# EAGLE design NXT Shield (EAGLE 5.11)
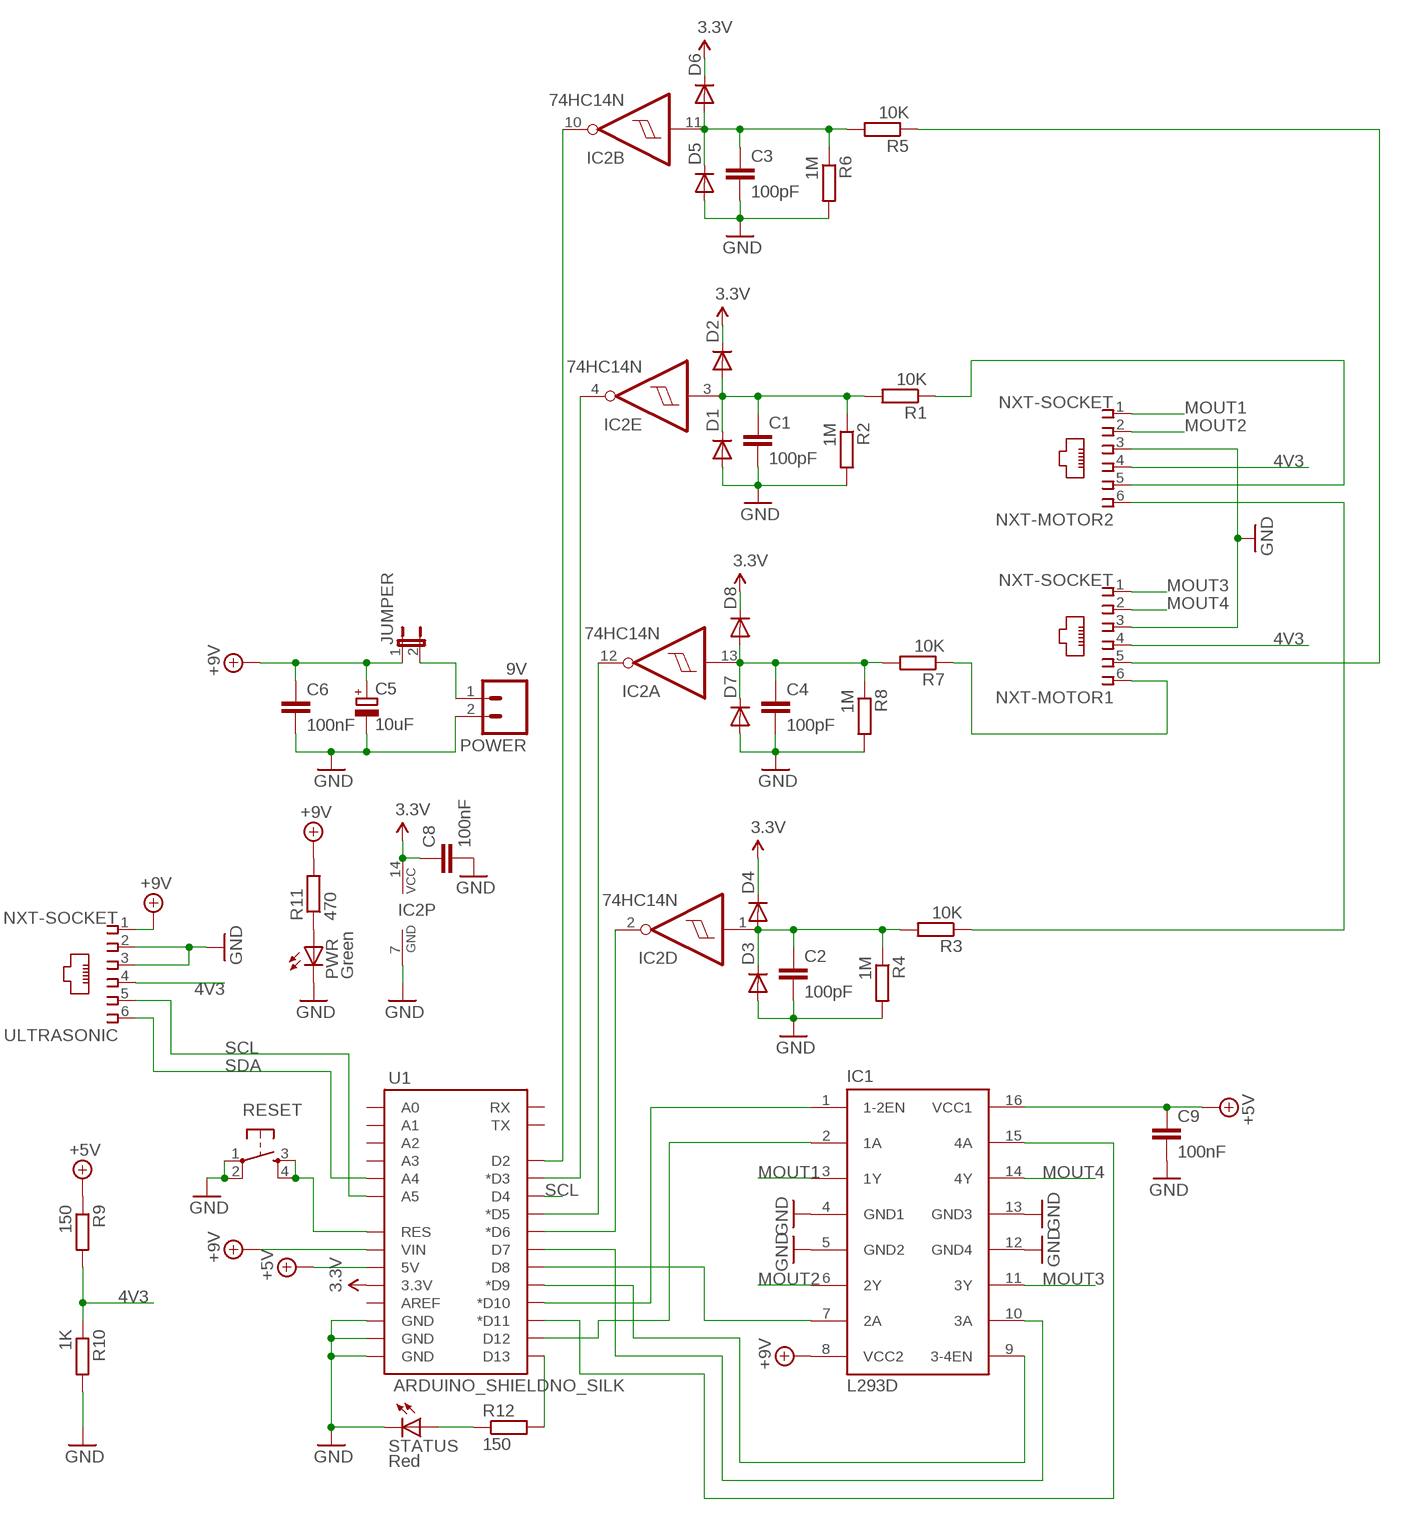
[diagram p0: schematic, sheet 1]

## Parts
C1  100pF  C-EU050-024X044  [C050-024X044]
C2  100pF  C-EU050-024X044  [C050-024X044]
C3  100pF  C-EU050-024X044  [C050-024X044]
C4  100pF  C-EU050-024X044  [C050-024X044]
C5  10uF  CPOL-EUE2-5  [E2-5]
C6  100nF  C-EU050-024X044  [C050-024X044]
C8  100nF  C-EU050-024X044  [C050-024X044]
C9  100nF  C-EU050-024X044  [C050-024X044]
D1  DIODE1N4148  [DIODE-1N4148]
D2  DIODE1N4148  [DIODE-1N4148]
D3  DIODE1N4148  [DIODE-1N4148]
D4  DIODE1N4148  [DIODE-1N4148]
D5  DIODE1N4148  [DIODE-1N4148]
D6  DIODE1N4148  [DIODE-1N4148]
D7  DIODE1N4148  [DIODE-1N4148]
D8  DIODE1N4148  [DIODE-1N4148]
IC1  L293D  [DIL16]
IC2  74HC14N  [DIL14]
JUMPER  JP1E  [JP1]
NXT-MOTOR1  NXT-SOCKET  [NXT-SOCKET]
NXT-MOTOR2  NXT-SOCKET  [NXT-SOCKET]
POWER  9V  M025MM  [SCREWTERMINAL-5MM-2]
PWR  Green  LED3MM  [LED3MM]
R1  10K  R-EU_0207/10  [0207/10]
R2  1M  R-EU_0207/10  [0207/10]
R3  10K  R-EU_0207/10  [0207/10]
R4  1M  R-EU_0207/10  [0207/10]
R5  10K  R-EU_0207/10  [0207/10]
R6  1M  R-EU_0207/10  [0207/10]
R7  10K  R-EU_0207/10  [0207/10]
R8  1M  R-EU_0207/10  [0207/10]
R9  150  R-EU_0207/10  [0207/10]
R10  1K  R-EU_0207/10  [0207/10]
R11  470  R-EU_0207/10  [0207/10]
R12  150  R-EU_0207/10  [0207/10]
RESET  TAC_SWITCHPTH  [TACTILE-PTH]
STATUS  Red  LED3MM  [LED3MM]
U1  ARDUINO_SHIELDNO_SILK  [DUEMILANOVE_VIAS]
ULTRASONIC  NXT-SOCKET  [NXT-SOCKET]

## Nets
3.3V: C8.1 D2.C D4.C D6.C D8.C IC2.14(P:VCC) U1.3.3V
4V3: NXT-MOTOR1.4 NXT-MOTOR2.4 R9.2 R10.1 ULTRASONIC.4
+5V: C9.1 IC1.16(VCC1) R9.1 U1.5V
+9V: C5.+ C6.1 IC1.8(VCC2) JUMPER.1 R11.2 U1.VIN ULTRASONIC.1
GND: C1.2 C2.2 C3.2 C4.2 C5.- C6.2 C8.2 C9.2 D1.A D3.A D5.A D7.A IC1.4(GND1) IC1.5(GND2) IC1.12(GND4) IC1.13(GND3) IC2.7(P:GND) NXT-MOTOR1.3 NXT-MOTOR2.3 POWER.2 PWR.K(C) R2.2 R4.2 R6.2 R8.2 R10.2 RESET.1 RESET.2 STATUS.K(C) U1.GND@0(GND) U1.GND@1(GND) U1.GND@2(GND) ULTRASONIC.2 ULTRASONIC.3
MOUT1: IC1.3(1Y) NXT-MOTOR2.1
MOUT2: IC1.6(2Y) NXT-MOTOR2.2
MOUT3: IC1.11(3Y) NXT-MOTOR1.1
MOUT4: IC1.14(4Y) NXT-MOTOR1.2
N$1: IC2.2(D:O) U1.D6(*D6)
N$2: IC2.12(A:O) U1.D5(*D5)
N$3: IC2.4(E:O) U1.D3(*D3)
N$4: IC2.10(B:O) U1.D2
N$5: IC1.2(1A) U1.D12
N$6: IC1.7(2A) U1.D8
N$7: IC1.1(1-2EN) U1.D10(*D10)
N$8: IC1.9(3-4EN) U1.D9(*D9)
N$9: IC1.10(3A) U1.D7
N$10: R12.1 STATUS.A
N$11: IC1.15(4A) U1.D11(*D11)
N$12: NXT-MOTOR2.6 R3.1
N$13: R12.2 U1.D13
N$14: NXT-MOTOR2.5 R1.1
N$15: RESET.3 RESET.4 U1.RES
N$16: NXT-MOTOR1.5 R5.1
N$17: PWR.A R11.1
N$21: C2.1 D3.C D4.A IC2.1(D:I) R3.2 R4.1
N$22: C1.1 D1.C D2.A IC2.3(E:I) R1.2 R2.1
N$23: C4.1 D7.C D8.A IC2.13(A:I) R7.2 R8.1
N$26: JUMPER.2 POWER.1
N$27: C3.1 D5.C D6.A IC2.11(B:I) R5.2 R6.1
NXT-MOTOR2: NXT-MOTOR1.6 R7.1
SCL: U1.A5 U1.D4 ULTRASONIC.5
SDA: U1.A4 ULTRASONIC.6
Unconnected: IC2.5(F:I) IC2.6(F:O) IC2.8(C:O) IC2.9(C:I) U1.A0 U1.A1 U1.A2 U1.A3 U1.AREF U1.RX U1.TX

## Library data of the parts
C1-C4 C6 C8 C9 = rcl:C-EU: CAPACITOR, European symbol
C5 = rcl:CPOL-EU: POLARIZED CAPACITOR, European symbol
D1-D8 = SparkFun:DIODE: Diode These are standard reverse protection diodes and small signal diodes. SMA package can handle up to about 1A. SOD-323 can handle about 200mA. What the SOD-323 package when ordering, there are some mfgs out there that are 5-pin packages.
IC1 = st-microelectronics:L293D: PUSH-PULL 4 CHANNEL DRIVER; MPN: L293D; OC_FARNELL: 9589619; OC_NEWARK: 56P8249
IC2 = 74xx-eu:74*14: Hex schmitt trigger INVERTER
JUMPER = jumper:JP1E: JUMPER
NXT-MOTOR1 NXT-MOTOR2 ULTRASONIC = Mindstorms:NXT-SOCKET: RJ11 6 connects Manufacturer: Mindsensors.com Source: NXT-Female-Socket.pdf; OC_FARNELL: unknown; OC_NEWARK: unknown
POWER = SparkFun:M02: Header 2 Standard 2-pin 0.1" header. Use with straight break away headers (SKU : PRT-00116), right angle break away headers (PRT-00553), swiss pins (PRT-00743), machine pins (PRT-00117), and female headers (PRT-00115). Molex polarized connector foot print use with SKU : PRT-08233 with associated crimp pins and housings.
PWR STATUS = led:LED: LED OSRAM: - CHIPLED LG R971, LG N971, LY N971, LG Q971, LY Q971, LO R971, LY R971 LH N974, LH R974 LS Q976, LO Q976, LY Q976 LO Q996 - Hyper CHIPLED LW Q18S LB Q993, LB Q99A, LB R99A - SideLED LS A670, LO A670, LY A670, LG A670, LP A670 LB A673, LV A673, LT A673, LW A673 LH A674 LY A675 LS A676, LA A676, LO A676, LY A676, LW A676 LS A679, LY A679, LG A679 - Hyper Micro SIDELED® LS Y876, LA Y876, LO Y876, LY Y876 LT Y87S - SmartLED LW L88C, LW L88S LB L89C, LB L89S, LG L890 LS L89K, LO L89K, LY L89K LS L896, LA L896, LO L896, LY L896 - TOPLED LS T670, LO T670, LY T670, LG T670, LP T670 LSG T670, LSP T670, LSY T670, LOP T670, LYG T670 LG T671, LOG T671, LSG T671 LB T673, LV T673, LT T673, LW T673 LH T674 LS T676, LA T676, LO T676, LY T676, LB T676, LH T676, LSB T676, LW T676 LB T67C, LV T67C, LT T67C, LS T67K, LO T67K, LY T67K, LW E67C LS E67B, LA E67B, LO E67B, LY E67B, LB E67C, LV E67C, LT E67C LW T67C LS T679, LY T679, LG T679 LS T770, LO T770, LY T770, LG T770, LP T770 LB T773, LV T773, LT T773, LW T773 LH T774 LS E675, LA E675, LY E675, LS T675 LS T776, LA T776, LO T776, LY T776, LB T776 LHGB T686 LT T68C, LB T68C - Hyper Mini TOPLED® LB M676 - Mini TOPLED Santana® LG M470 LS M47K, LO M47K, LY M47K Source: http://www.osram.convergy.de LUXEON: - LUMILED® LXK2-PW12-R00, LXK2-PW12-S00, LXK2-PW14-U00, LXK2-PW14-V00 LXK2-PM12-R00, LXK2-PM12-S00, LXK2-PM14-U00 LXK2-PE12-Q00, LXK2-PE12-R00, LXK2-PE12-S00, LXK2-PE14-T00, LXK2-PE14-U00 LXK2-PB12-K00, LXK2-PB12-L00, LXK2-PB12-M00, LXK2-PB14-N00, LXK2-PB14-P00, LXK2-PB14-Q00 LXK2-PR12-L00, LXK2-PR12-M00, LXK2-PR14-Q00, LXK2-PR14-R00 LXK2-PD12-Q00, LXK2-PD12-R00, LXK2-PD12-S00 LXK2-PH12-R00, LXK2-PH12-S00 LXK2-PL12-P00, LXK2-PL12-Q00, LXK2-PL12-R00 Source: www.luxeon.com KINGBRIGHT: KA-3528ASYC Source: www.kingbright.com
R1-R12 = rcl:R-EU_: RESISTOR, European symbol
RESET = SparkFun:TAC_SWITCH: Momentary Switch Button commonly used for reset or general input. Spark Fun Electronics SKU : COM-00097
U1 = Mindstorms:ARDUINO_SHIELD

## Board
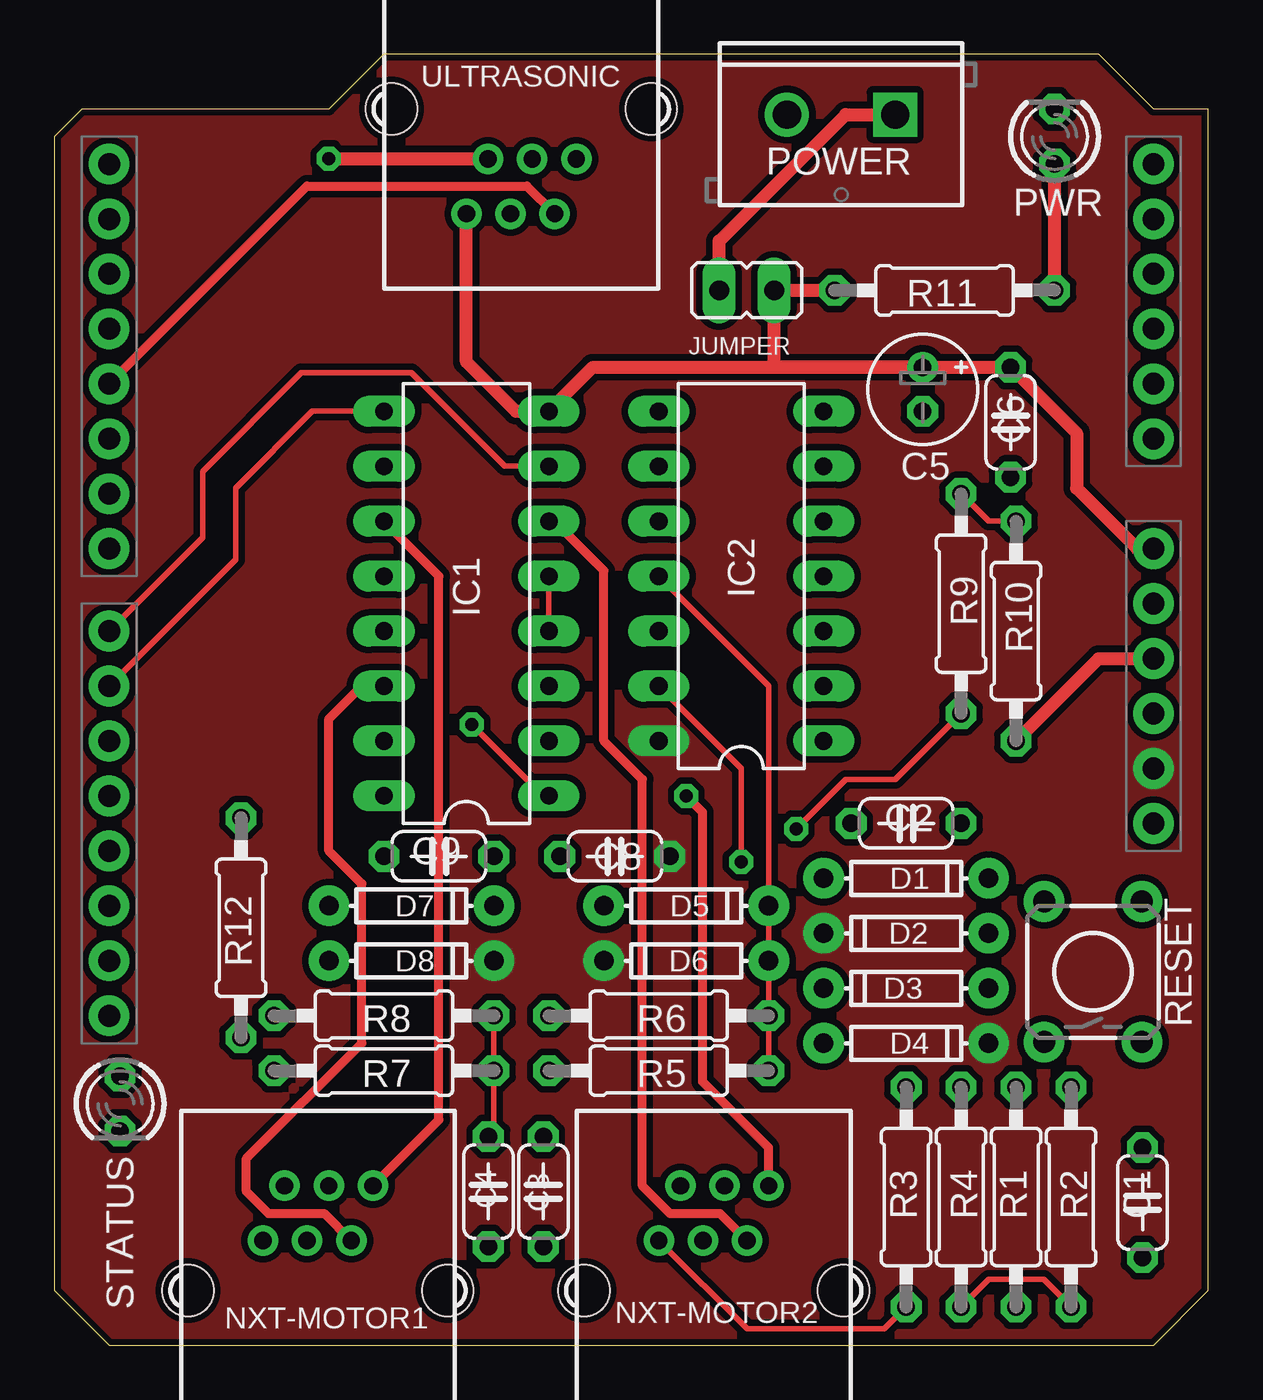
[diagram p1: board, top side]
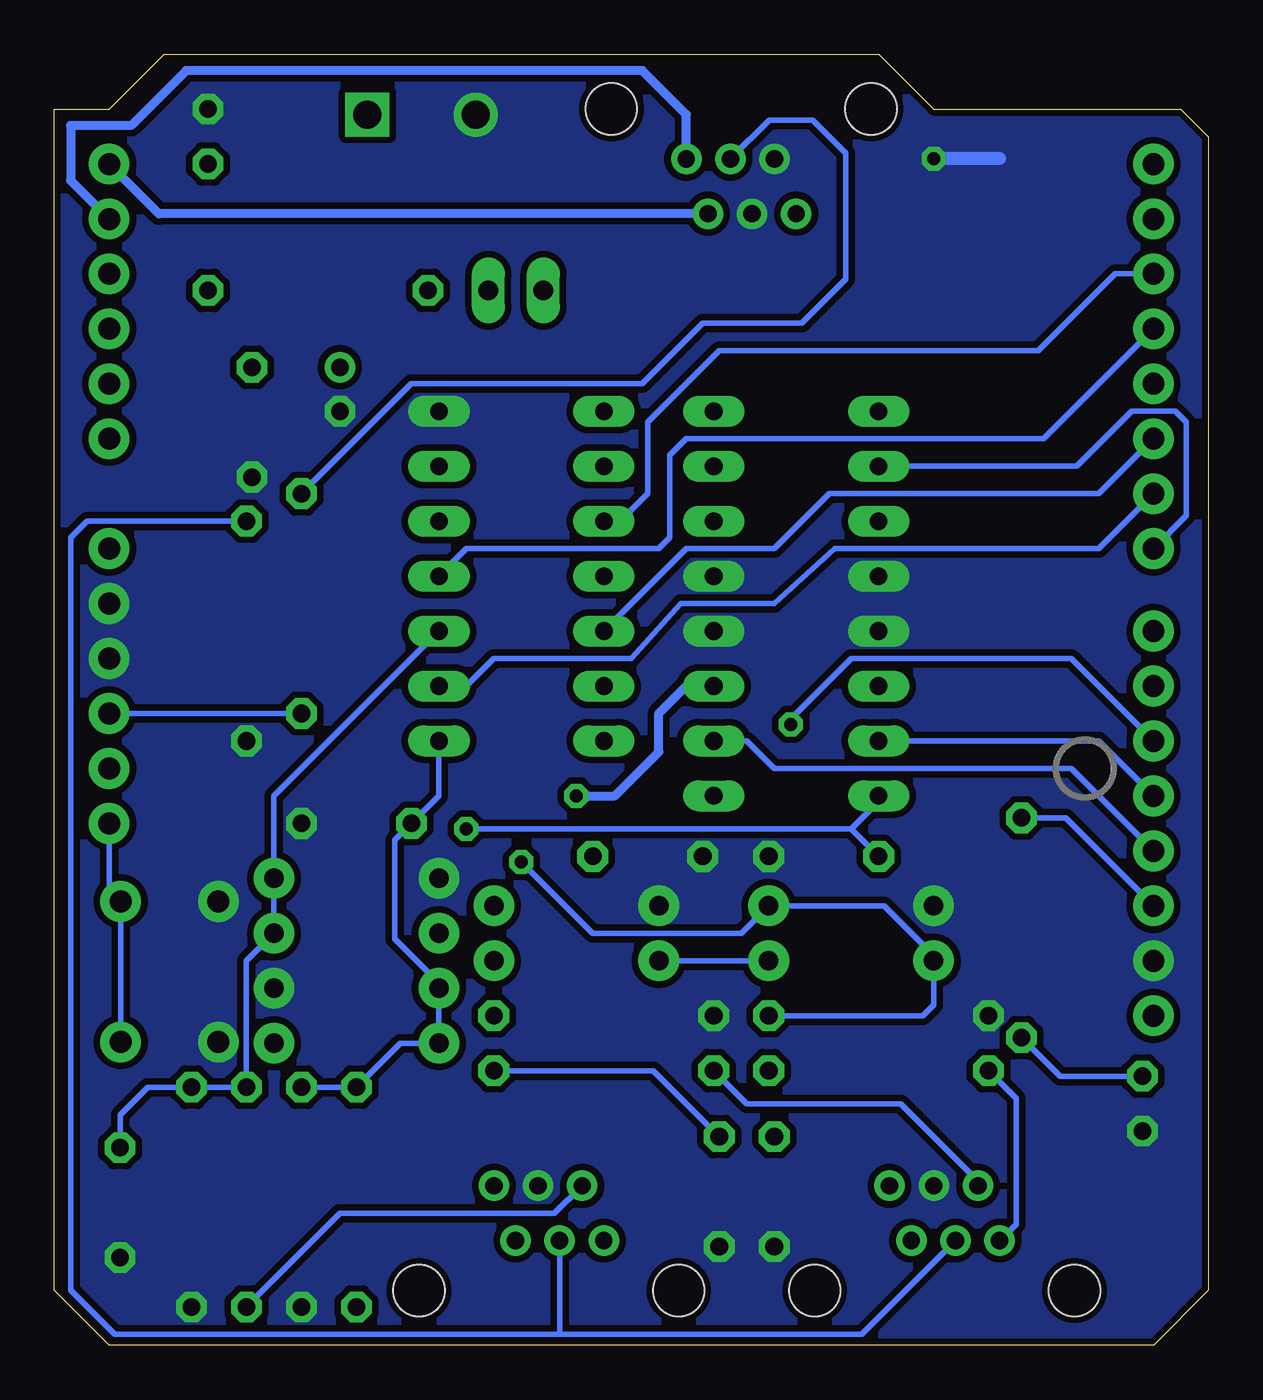
[diagram p2: board, bottom side, seen from below]

Size 53.34 x 59.69 mm. Coordinates in mm from the lower left corner, seen from the top.
Outline: 50.8,0 53.34,2.54 53.34,57.15 50.8,57.15 48.26,59.69 15.24,59.69 12.7,57.15 1.27,57.15 0,55.88 0,2.54 2.54,0 50.8,0
Copper layers (1*16): Top 0.035mm / dielectric 1.5mm / Bottom 0.035mm
Design rules "ThomasDRC_Recommended_8mil": minimum track width 8mil, minimum drill 20mil, track to track 8mil, track to pad 8mil, pad to pad 8mil, via to via 8mil, smd to smd 8mil, copper to edge 8mil, drill to drill 8mil, minimum pad ring 12mil, minimum via ring 10mil, stop-mask expansion 4mil, vias tented up to drill 25mil, thermal gap 10mil

### Footprints (pad centres in the part's own frame; a part is rotated, then mirrored left to right if it is on the bottom)
C050-024X044 = drill 0.813 octagon: 1 -2.54,0; 2 2.54,0
E2-5 = drill 0.813 pad 1.27 round: + -1.016,0 | drill 0.813 pad 1.27 octagon: - 1.016,0
DIODE-1N4148 = drill 0.9 pad 1.88 round: A -3.81,0; C 3.81,0
DIL16 = drill 0.813 long: 1 -8.89,-3.81; 2 -6.35,-3.81; 3 -3.81,-3.81; 4 -1.27,-3.81; 5 1.27,-3.81; 6 3.81,-3.81; 7 6.35,-3.81; 8 8.89,-3.81; 9 8.89,3.81; 10 6.35,3.81; 11 3.81,3.81; 12 1.27,3.81; 13 -1.27,3.81; 14 -3.81,3.81; 15 -6.35,3.81; 16 -8.89,3.81
DIL14 = drill 0.813 long: 1 -7.62,-3.81; 2 -5.08,-3.81; 3 -2.54,-3.81; 4 0,-3.81; 5 2.54,-3.81; 6 5.08,-3.81; 7 7.62,-3.81; 8 7.62,3.81; 9 5.08,3.81; 10 2.54,3.81; 11 0,3.81; 12 -2.54,3.81; 13 -5.08,3.81; 14 -7.62,3.81
JP1 = drill 0.914 long: 1 0,-1.27; 2 0,1.27
NXT-SOCKET = drill 0.8 pad 1.3 round: 1 2.54,4.84; 2 1.54,2.3; 3 0.5,4.84; 4 -0.5,2.3; 5 -1.54,4.84; 6 -2.54,2.3 | hole 2.36: -6,0; 6,0
SCREWTERMINAL-5MM-2 = drill 1.3 pad 2.032 square: 1 0,0 | drill 1.3 pad 2.032 round: 2 5,0
LED3MM = drill 0.813 octagon: A -1.27,0; K 1.27,0
0207/10 = drill 0.813 octagon: 1 -5.08,0; 2 5.08,0
TACTILE-PTH = drill 1.016 pad 1.88 round: 1 -3.251,2.261; 2 3.251,2.261; 3 -3.251,-2.261; 4 3.251,-2.261
DUEMILANOVE_VIAS = drill 1.016 pad 1.88 round: 3.3V 50.8,13.97; 5V 50.8,16.51; A0 50.8,29.21; A1 50.8,31.75; A2 50.8,34.29; A3 50.8,36.83; A4 50.8,39.37; A5 50.8,41.91; AREF 2.54,2.54; D2 2.54,36.83; D3 2.54,34.29; D4 2.54,31.75; D5 2.54,29.21; D6 2.54,26.67; D7 2.54,24.13; D8 2.54,20.32; D9 2.54,17.78; D10 2.54,15.24; D11 2.54,12.7; D12 2.54,10.16; D13 2.54,7.62; GND@0 50.8,19.05; GND@1 50.8,21.59; GND@2 2.54,5.08; RES 50.8,11.43; RX 2.54,41.91; TX 2.54,39.37; VIN 50.8,24.13

### Placement (x,y rotation side)
C1  50.29,6.6 270 top
C2  39.37,24.13 0 top
C3  22.61,7.11 270 top
C4  20.07,7.11 270 top
C5  40.13,44.2 270 top
C6  44.2,42.67 270 top
C8  25.91,22.61 180 top
C9  17.78,22.61 0 top
D1  39.37,21.59 0 top
D2  39.37,19.05 180 top
D3  39.37,16.51 180 top
D4  39.37,13.97 0 top
D5  29.21,20.32 0 top
D6  29.21,17.78 180 top
D7  16.51,20.32 0 top
D8  16.51,17.78 0 top
IC1  19.05,34.29 90 top
IC2  31.75,35.56 90 top
JUMPER  32,48.77 90 top
NXT-MOTOR1  12.19,2.54 0 top
NXT-MOTOR2  30.48,2.54 0 top
POWER  38.86,56.9 180 top
PWR  46.23,55.88 90 top
R1  44.45,6.86 90 top
R2  46.99,6.86 270 top
R3  39.37,6.86 90 top
R4  41.91,6.86 270 top
R5  27.94,12.7 0 top
R6  27.94,15.24 180 top
R7  15.24,12.7 0 top
R8  15.24,15.24 180 top
R9  41.91,34.29 90 top
R10  44.45,33.02 270 top
R11  41.15,48.77 180 top
R12  8.64,19.3 90 top
RESET  48.01,17.27 90 top
STATUS  3.05,11.18 270 top
U1  0,12.7 0 top
ULTRASONIC  21.59,57.15 180 top

### Tracks (layer width: path | path; a pad name or v marks a point on that pad's centre or on a via)
3.3V
  Bottom 0.254: D8.C D6.C
  pour Top (isolate 0.305, no thermals): -8.89,65.02 61.72,65.02 62.48,-8.89 -9.4,-9.14
4V3
  Top 0.254: R10.1 43.18,38.1 R9.2
  Bottom 0.254: R9.2 36.83,44.45 26.16,44.45 23.37,47.24 18.8,47.24 16.76,49.28 16.76,55.12 18.29,56.64 20.3,56.64 ULTRASONIC.4 | R10.1 51.82,38.1 52.58,37.34 52.58,2.54 50.55,0.51 29.98,0.51 | 29.98,0.51 NXT-MOTOR2.4 | 29.98,0.51 16.02,0.51 NXT-MOTOR1.4
+5V  (via drill 0.6)
  Top 0.254: v34.29,23.88 36.58,26.16 38.86,26.16 R9.1
  Bottom 0.254: R9.1 U1.5V | IC1.16 15.24,25.15 16.51,23.88 | 16.51,23.88 v34.29,23.88 | C9.1 16.51,23.88
+9V
  Top 0.61: ULTRASONIC.1 19.05,45.47 21.34,43.18 IC1.8 24.89,45.21 C5.+ | C5.+ C6.1 47.24,42.16 47.24,39.62 50.04,36.83 U1.VIN | R11.2 JUMPER.1 33.27,45.21 C5.+
GND  (via drill 0.6)
  Top 0.254: IC1.4 IC1.5 | R4.2 43.18,3.05 45.72,3.05 R2.2
  Top 0.61: U1.GND@0 48.26,31.75 R10.2 | ULTRASONIC.2 12.71,54.85 v12.7,54.86
  Bottom 0.61: 9.65,54.86 v12.7,54.86
  pour Bottom (isolate 0.305, no thermals): -7.11,63.75 60.45,64.01 60.71,-7.87 -8.38,-7.87
MOUT1  (via drill 0.6)
  Top 0.406: NXT-MOTOR2.1 33.02,9.14 29.97,12.19 29.97,24.64 v29.21,25.4
  Bottom 0.406: IC1.3 24.13,30.48 25.4,29.21 25.4,27.43 27.43,25.4 v29.21,25.4
MOUT2
  Top 0.406: IC1.6 23.11,38.1 25.4,35.81 25.4,27.94 27.18,26.16 27.18,7.37 28.45,6.1 30.76,6.1 NXT-MOTOR2.2
MOUT3
  Top 0.406: IC1.11 17.78,35.56 17.78,10.43 NXT-MOTOR1.1
MOUT4
  Top 0.406: NXT-MOTOR1.2 12.48,6.1 9.91,6.1 8.89,7.11 8.89,8.64 14.22,13.97 14.22,21.34 12.7,22.86 12.7,28.96 14.22,30.48 IC1.14
N$1
  Bottom 0.254: U1.D6 5.08,36.83 17.27,36.83 20.07,34.29 24.38,34.29 26.67,31.75 33.02,31.75 34.29,30.48 IC2.2
N$2
  Bottom 0.254: U1.D5 5.08,39.37 17.53,39.37 20.07,36.83 24.13,36.83 IC2.12
N$3
  Bottom 0.254: U1.D3 7.62,41.91 24.13,41.91 24.89,41.15 24.89,37.34 25.4,36.83 34.29,36.83 IC2.4
N$4
  Bottom 0.254: IC2.10 27.18,38.1 25.91,39.37 25.91,42.67 22.61,45.97 7.87,45.97 4.32,49.53 U1.D2
N$5
  Bottom 0.254: U1.D12 6.35,26.67 20.07,26.67 21.34,27.94 IC1.2
N$6
  Top 0.254: IC1.7 20.83,40.64 16.51,44.96 11.43,44.96 6.86,40.39 6.86,37.34 U1.D8
N$7  (via drill 0.6)
  Top 0.254: v19.3,28.7 22.61,25.4 IC1.1
  Bottom 0.254: U1.D10 6.35,31.75 16.51,31.75 19.3,28.96 v19.3,28.7
N$8
  Top 0.254: IC1.9 11.94,43.18 8.38,39.62 8.38,36.32 U1.D9
N$9
  Bottom 0.254: U1.D7 1.02,38.35 1.02,42.67 1.52,43.18 3.56,43.18 6.1,40.64 IC1.10
N$10
  Bottom 0.254: R12.1 6.86,12.45 STATUS.A
N$11
  Bottom 0.254: U1.D11 5.08,27.94 IC1.15
N$12
  Top 0.254: NXT-MOTOR2.6 32.02,0.76 38.35,0.76 R3.1
N$13
  Bottom 0.254: U1.D13 6.6,24.38 R12.2
N$14
  Bottom 0.254: NXT-MOTOR2.5 30.22,6.1 40.13,6.1 R1.1
N$15
  Bottom 0.254: RESET.3 RESET.4 50.8,21.06 U1.RES
N$16
  Bottom 0.254: NXT-MOTOR1.5 10.65,7.6 14.22,11.18 21.34,11.18 R5.1
N$17
  Top 0.61: R11.1 PWR.A
N$21
  Bottom 0.254: R4.1 R3.2 37.34,13.97 D4.A D3.C 35.56,16.76 37.59,18.8 37.59,23.37 C2.1 35.56,25.4 IC2.1
N$22
  Bottom 0.254: IC2.3 43.18,25.4 D1.C D2.A 44.45,17.78 R1.2 R2.1 49.02,11.94 50.29,10.67 C1.1
N$23  (via drill 0.6)
  Top 0.254: R8.1 R7.2 20.32,9.91 C4.1 | IC2.13 31.75,26.67 v31.75,22.35
  Bottom 0.254: R8.1 13.21,15.24 12.7,15.75 D8.A 12.7,18.03 14.99,20.32 D7.C 21.59,19.05 28.45,19.05 v31.75,22.35
N$26
  Top 0.61: JUMPER.2 30.73,51.05 36.58,56.9 POWER.1
N$27
  Top 0.254: IC2.11 33.02,30.48 D5.C D6.A R6.1 R5.2
  Bottom 0.254: R5.2 25.65,12.7 C3.1
NXT-MOTOR2
  Bottom 0.254: R7.1 8.89,11.43 8.89,5.6 NXT-MOTOR1.6
SCL
  Top 0.254: ULTRASONIC.5
  Top 0.406: U1.D4 11.68,53.59 21.84,53.59 ULTRASONIC.5
  Bottom 0.406: U1.A5 48.5,52.31 ULTRASONIC.5
SDA
  Bottom 0.406: U1.A4 52.58,53.85 52.58,56.39 49.78,56.39 47.24,58.93 26.16,58.93 24.13,56.9 ULTRASONIC.6

### Text on the board
tDocu: SENSOR | GND | +9V | NXT Shield
bDocu: ULTRASONIC | SENSOR | TKJ Electronics | c | December 2011 | V1.0 | NXT MOTOR1 | NXT MOTOR2